# EasyEDA schematic SCH_The-Weather-Station_2024-06-20.json
TITLE: Sheet_1; REV: 1.0; Date: 2024-05-08; Sheet: 1/1; Drawn By: divya_gsg; Company: Your Company
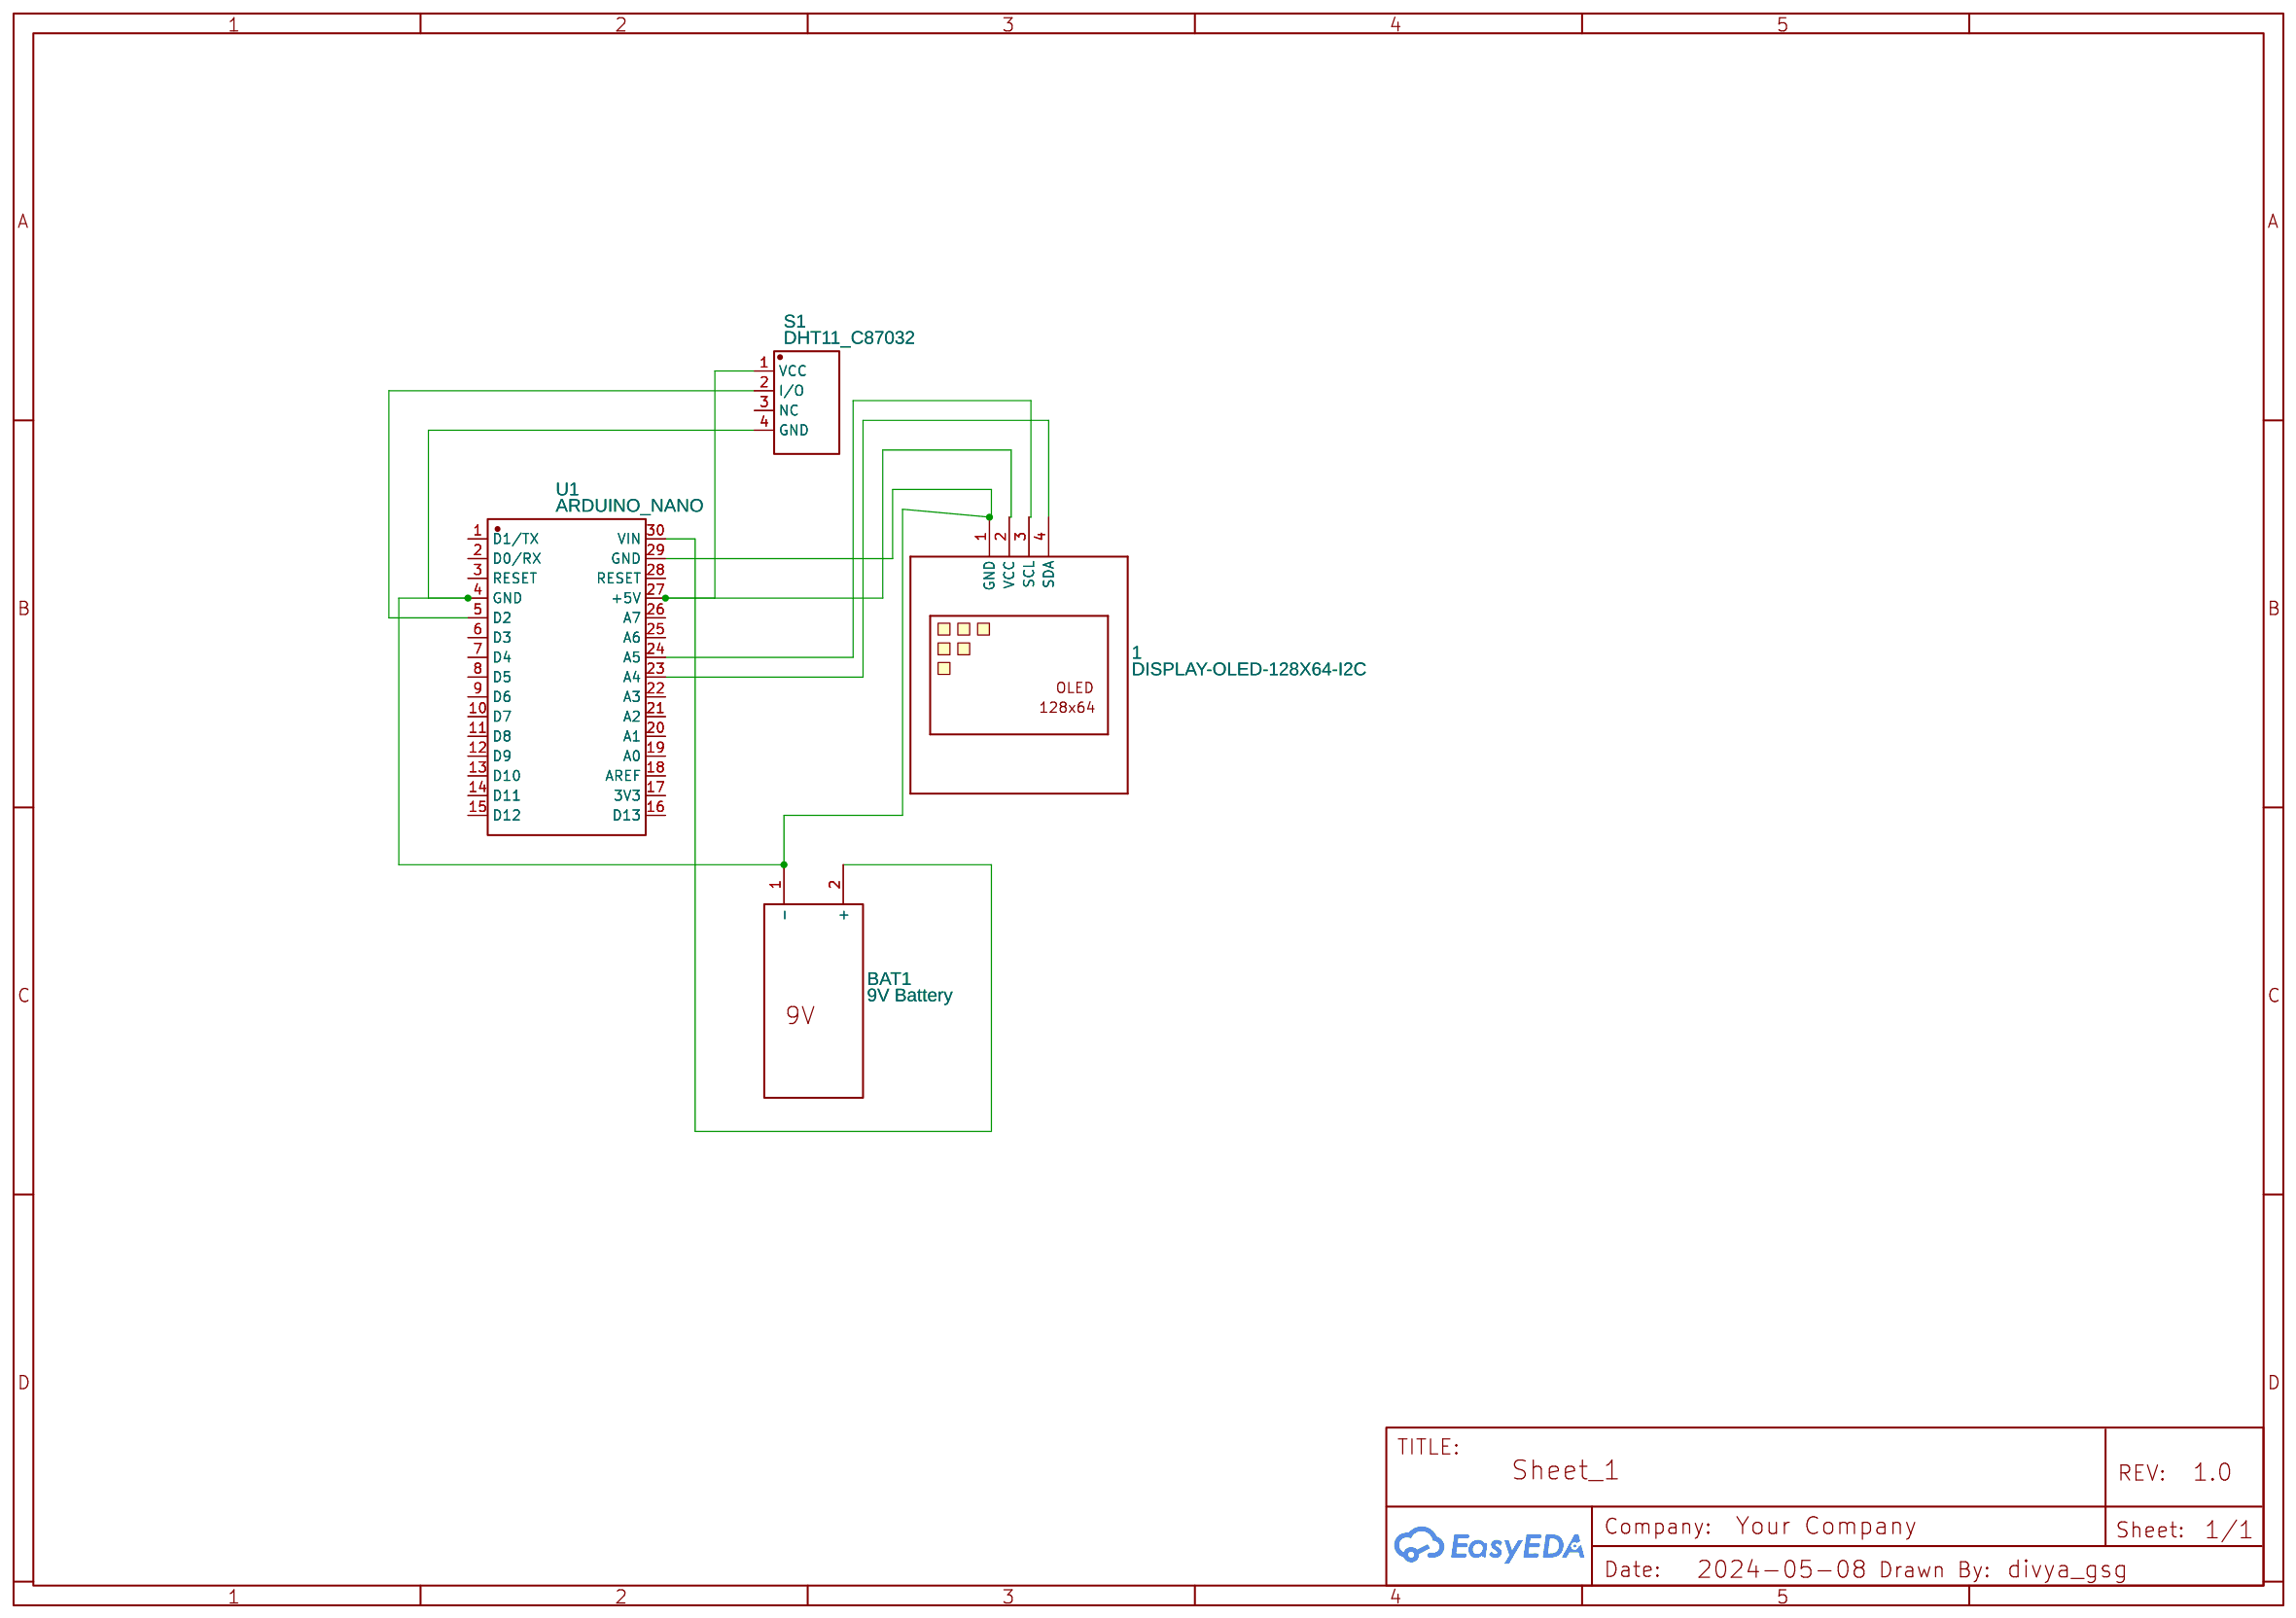
[diagram p0: schematic sheet]

## Parts
1  DISPLAY-OLED-128X64-I2C  [DISPLAY-OLED-128X64-I2C]
BAT1  9V Battery  [9V BATTERY]
S1  DHT11_C87032  [SENSOR-TH_DHT11-1]
U1  ARDUINO_NANO  [COMM-TH_ARDUINO_NANO]

## Library data of the parts
1 = DISPLAY-OLED-128X64-I2C: Contributor: Derrek Van Ee (BlenderTek)
BAT1 = 9V Battery: Contributor: QuantumEDA
S1 = DHT11_C87032: Supplier Part: C87032; Supplier: LCSC; Manufacturer: AOSONG; Manufacturer Part: DHT11; JLCPCB Part Class: Extended Part
U1 = ARDUINO_NANO: Contributor: lcsc; Supplier: LCSC; Supplier Part: C9900017879; Manufacturer: null; JLCPCB Part Class: Extended Part

## Nets
Net-(1-1): 1.1(GND) BAT1.1(-) S1.4(GND) U1.4(GND) U1.29(GND)
Net-(1-2): 1.2(VCC) S1.1(VCC) U1.27(+5V)
Net-(1-3): 1.3(SCL) U1.24(A5)
Net-(1-4): 1.4(SDA) U1.23(A4)
Net-(BAT1-2): BAT1.2(+) U1.30(VIN)
Net-(S1-2): S1.2(I/O) U1.5(D2)

Not connected (* = marked no-connect by the designer): S1 3(NC); U1 1(D1/TX) 2(D0/RX) 3(RESET) 6(D3) 7(D4) 8(D5) 9(D6) 10(D7) 11(D8) 12(D9) 13(D10) 14(D11) 15(D12) 16(D13) 17(3V3) 18(AREF) 19(A0) 20(A1) 21(A2) 22(A3) 25(A6) 26(A7) 28(RESET)
